# EAGLE design KEYb_final-rev01 (EAGLE 9.6.2)
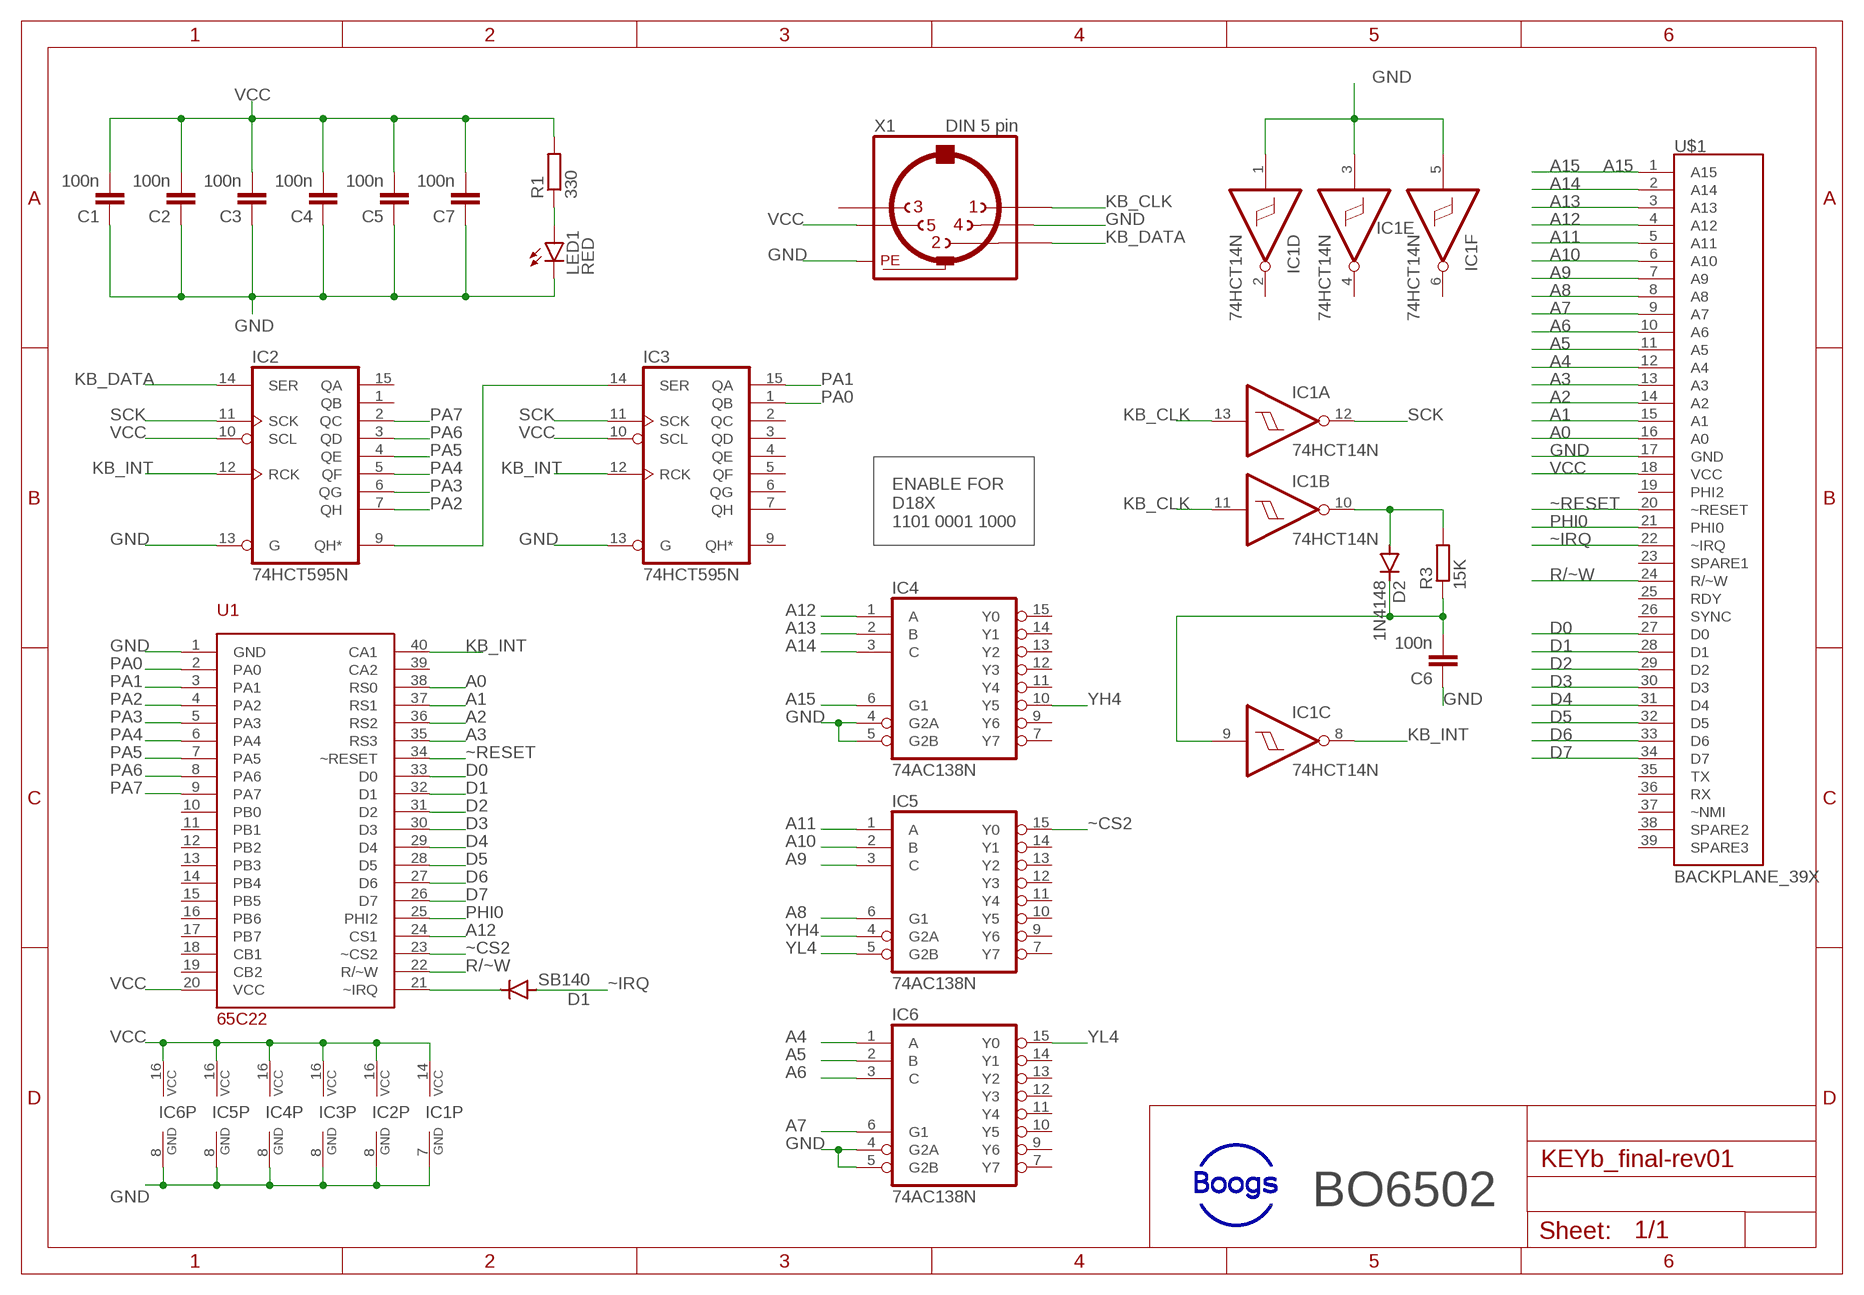
[diagram p0: schematic, sheet 1]

## Parts
C1  100n  C-EU025-025X050  [C025-025X050]
C2  100n  C-EU025-025X050  [C025-025X050]
C3  100n  C-EU025-025X050  [C025-025X050]
C4  100n  C-EU025-025X050  [C025-025X050]
C5  100n  C-EU025-025X050  [C025-025X050]
C6  100n  C-EU025-025X050  [C025-025X050]
C7  100n  C-EU025-025X050  [C025-025X050]
D1  SB140  1N4004  [DO41-10]
D2  1N4148  1N4148DO35-7  [DO35-7]
IC1  74HCT14N  [DIL14]
IC2  74HCT595N  [DIL16]
IC3  74HCT595N  [DIL16]
IC4  74AC138N  [DIL16]
IC5  74AC138N  [DIL16]
IC6  74AC138N  [DIL16]
LED1  RED  LED5MM  [LED5MM]
R1  330  R-EU_0207/10  [0207/10]
R3  15K  R-EU_0207/10  [0207/10]
U1  65C22  [DIL40]
U$1  BACKPLANE_39X  [BP_39X]
X1  DIN 5 pin  MAB5SH  [MAB5SH]

## Nets
A0: U1.38(RS0) U$1.16(A0)
A1: U1.37(RS1) U$1.15(A1)
A2: U1.36(RS2) U$1.14(A2)
A3: U1.35(RS3) U$1.13(A3)
A4: IC6.1(A) U$1.12(A4)
A5: IC6.2(B) U$1.11(A5)
A6: IC6.3(C) U$1.10(A6)
A7: IC6.6(G1) U$1.9(A7)
A8: IC5.6(G1) U$1.8(A8)
A9: IC5.3(C) U$1.7(A9)
A10: IC5.2(B) U$1.6(A10)
A11: IC5.1(A) U$1.5(A11)
A12: IC4.1(A) U1.24(CS1) U$1.4(A12)
A13: IC4.2(B) U$1.3(A13)
A14: IC4.3(C) U$1.2(A14)
A15: IC4.6(G1) U$1.1(A15)
D0: U1.33(D0) U$1.27(D0)
D1: U1.32(D1) U$1.28(D1)
D2: U1.31(D2) U$1.29(D2)
D3: U1.30(D3) U$1.30(D3)
D4: U1.29(D4) U$1.31(D4)
D5: U1.28(D5) U$1.32(D5)
D6: U1.27(D6) U$1.33(D6)
D7: U1.26(D7) U$1.34(D7)
GND: C1.1 C2.1 C3.1 C4.1 C5.1 C6.1 C7.1 IC1.1(D:I) IC1.3(E:I) IC1.5(F:I) IC1.7(P:GND) IC2.8(GND) IC2.13(G) IC3.8(GND) IC3.13(G) IC4.4(G2A) IC4.5(G2B) IC4.8(GND) IC5.8(GND) IC6.4(G2A) IC6.5(G2B) IC6.8(GND) LED1.K(C) U1.1(GND) U$1.17(GND) X1.4 X1.PE X1.PE@(PE)
KB_CLK: IC1.11(B:I) IC1.13(A:I) X1.1
KB_DATA: IC2.14(SER) X1.2
KB_INT: IC1.8(C:O) IC2.12(RCK) IC3.12(RCK) U1.40(CA1)
N$1: D1.C U1.21(~IRQ)
N$2: IC2.9(QH*) IC3.14(SER)
N$4: D2.A IC1.10(B:O) R3.2
N$5: C6.2 D2.C IC1.9(C:I) R3.1
N$6: LED1.A R1.1
PA0: IC3.1(QB) U1.2(PA0)
PA1: IC3.15(QA) U1.3(PA1)
PA2: IC2.7(QH) U1.4(PA2)
PA3: IC2.6(QG) U1.5(PA3)
PA4: IC2.5(QF) U1.6(PA4)
PA5: IC2.4(QE) U1.7(PA5)
PA6: IC2.3(QD) U1.8(PA6)
PA7: IC2.2(QC) U1.9(PA7)
PHI0: U1.25(PHI2) U$1.21(PHI0)
R/~W: U1.22(R/~W) U$1.24(R/~W)
SCK: IC1.12(A:O) IC2.11(SCK) IC3.11(SCK)
VCC: C1.2 C2.2 C3.2 C4.2 C5.2 C7.2 IC1.14(P:VCC) IC2.10(SCL) IC2.16(VCC) IC3.10(SCL) IC3.16(VCC) IC4.16(VCC) IC5.16(VCC) IC6.16(VCC) R1.2 U1.20(VCC) U$1.18(VCC) X1.5
YH4: IC4.10(Y5) IC5.4(G2A)
YL4: IC5.5(G2B) IC6.15(Y0)
~CS2: IC5.15(Y0) U1.23(~CS2)
~IRQ: D1.A U$1.22(~IRQ)
~RESET: U1.34(~RESET) U$1.20(~RESET)
Unconnected: IC1.2(D:O) IC1.4(E:O) IC1.6(F:O) IC2.1(QB) IC2.15(QA) IC3.2(QC) IC3.3(QD) IC3.4(QE) IC3.5(QF) IC3.6(QG) IC3.7(QH) IC3.9(QH*) IC4.7(Y7) IC4.9(Y6) IC4.11(Y4) IC4.12(Y3) IC4.13(Y2) IC4.14(Y1) IC4.15(Y0) IC5.7(Y7) IC5.9(Y6) IC5.10(Y5) IC5.11(Y4) IC5.12(Y3) IC5.13(Y2) IC5.14(Y1) IC6.7(Y7) IC6.9(Y6) IC6.10(Y5) IC6.11(Y4) IC6.12(Y3) IC6.13(Y2) IC6.14(Y1) U1.10(PB0) U1.11(PB1) U1.12(PB2) U1.13(PB3) U1.14(PB4) U1.15(PB5) U1.16(PB6) U1.17(PB7) U1.18(CB1) U1.19(CB2) U1.39(CA2) U$1.19(PHI2) U$1.23(SPARE1) U$1.25(RDY) U$1.26(SYNC) U$1.35(TX) U$1.36(RX) U$1.37(~NMI) U$1.38(SPARE2) U$1.39(SPARE3) X1.3

## Notes on the sheet
- ENABLE FOR
  D18X
  1101 0001 1000
- BO6502

## Library data of the parts
C1-C7 = rcl:C-EU: CAPACITOR, European symbol; SPICEPREFIX: C
D1 = diode:1N4004: DIODE general purpose rectifier, 1 A
D2 = diode:1N4148: DIODE high speed (Philips)
IC1 = 74xx-eu:74*14: Hex schmitt trigger INVERTER
IC2 IC3 = 74xx-eu:74*595: 8-bit SHIFT REGISTER, output latch
IC4-IC6 = 74xx-eu:74*138: 3-line to 8-line DECODER/DEMULTIPLEXER
LED1 = led:LED: LED OSRAM: - CHIPLED LG R971, LG N971, LY N971, LG Q971, LY Q971, LO R971, LY R971 LH N974, LH R974 LS Q976, LO Q976, LY Q976 LO Q996 - Hyper CHIPLED LW Q18S LB Q993, LB Q99A, LB R99A - SideLED LS A670, LO A670, LY A670, LG A670, LP A670 LB A673, LV A673, LT A673, LW A673 LH A674 LY A675 LS A676, LA A676, LO A676, LY A676, LW A676 LS A679, LY A679, LG A679 - Hyper Micro SIDELED® LS Y876, LA Y876, LO Y876, LY Y876 LT Y87S - SmartLED LW L88C, LW L88S LB L89C, LB L89S, LG L890 LS L89K, LO L89K, LY L89K LS L896, LA L896, LO L896, LY L896 - TOPLED LS T670, LO T670, LY T670, LG T670, LP T670 LSG T670, LSP T670, LSY T670, LOP T670, LYG T670 LG T671, LOG T671, LSG T671 LB T673, LV T673, LT T673, LW T673 LH T674 LS T676, LA T676, LO T676, LY T676, LB T676, LH T676, LSB T676, LW T676 LB T67C, LV T67C, LT T67C, LS T67K, LO T67K, LY T67K, LW E67C LS E67B, LA E67B, LO E67B, LY E67B, LB E67C, LV E67C, LT E67C LW T67C LS T679, LY T679, LG T679 LS T770, LO T770, LY T770, LG T770, LP T770 LB T773, LV T773, LT T773, LW T773 LH T774 LS E675, LA E675, LY E675, LS T675 LS T776, LA T776, LO T776, LY T776, LB T776 LHGB T686 LT T68C, LB T68C - Hyper Mini TOPLED® LB M676 - Mini TOPLED Santana® LG M470 LS M47K, LO M47K, LY M47K Source: http://www.osram.convergy.de LUXEON: - LUMILED® LXK2-PW12-R00, LXK2-PW12-S00, LXK2-PW14-U00, LXK2-PW14-V00 LXK2-PM12-R00, LXK2-PM12-S00, LXK2-PM14-U00 LXK2-PE12-Q00, LXK2-PE12-R00, LXK2-PE12-S00, LXK2-PE14-T00, LXK2-PE14-U00 LXK2-PB12-K00, LXK2-PB12-L00, LXK2-PB12-M00, LXK2-PB14-N00, LXK2-PB14-P00, LXK2-PB14-Q00 LXK2-PR12-L00, LXK2-PR12-M00, LXK2-PR14-Q00, LXK2-PR14-R00 LXK2-PD12-Q00, LXK2-PD12-R00, LXK2-PD12-S00 LXK2-PH12-R00, LXK2-PH12-S00 LXK2-PL12-P00, LXK2-PL12-Q00, LXK2-PL12-R00 Source: www.luxeon.com KINGBRIGHT: KA-3528ASYC Source: www.kingbright.com
R1 R3 = rcl:R-EU_: RESISTOR, European symbol; SPICEPREFIX: R
U1 = 65xx_family:65C22
U$1 = 65xx_family:BACKPLANE_39X; A15: A15
X1 = con-hirschmann_mod:MAB5SH: Female CONNECTOR 5 pins 90 deg. with shield, horizontal (DIN 41524); OC_FARNELL: 809883; OC_NEWARK: unknown

## Board
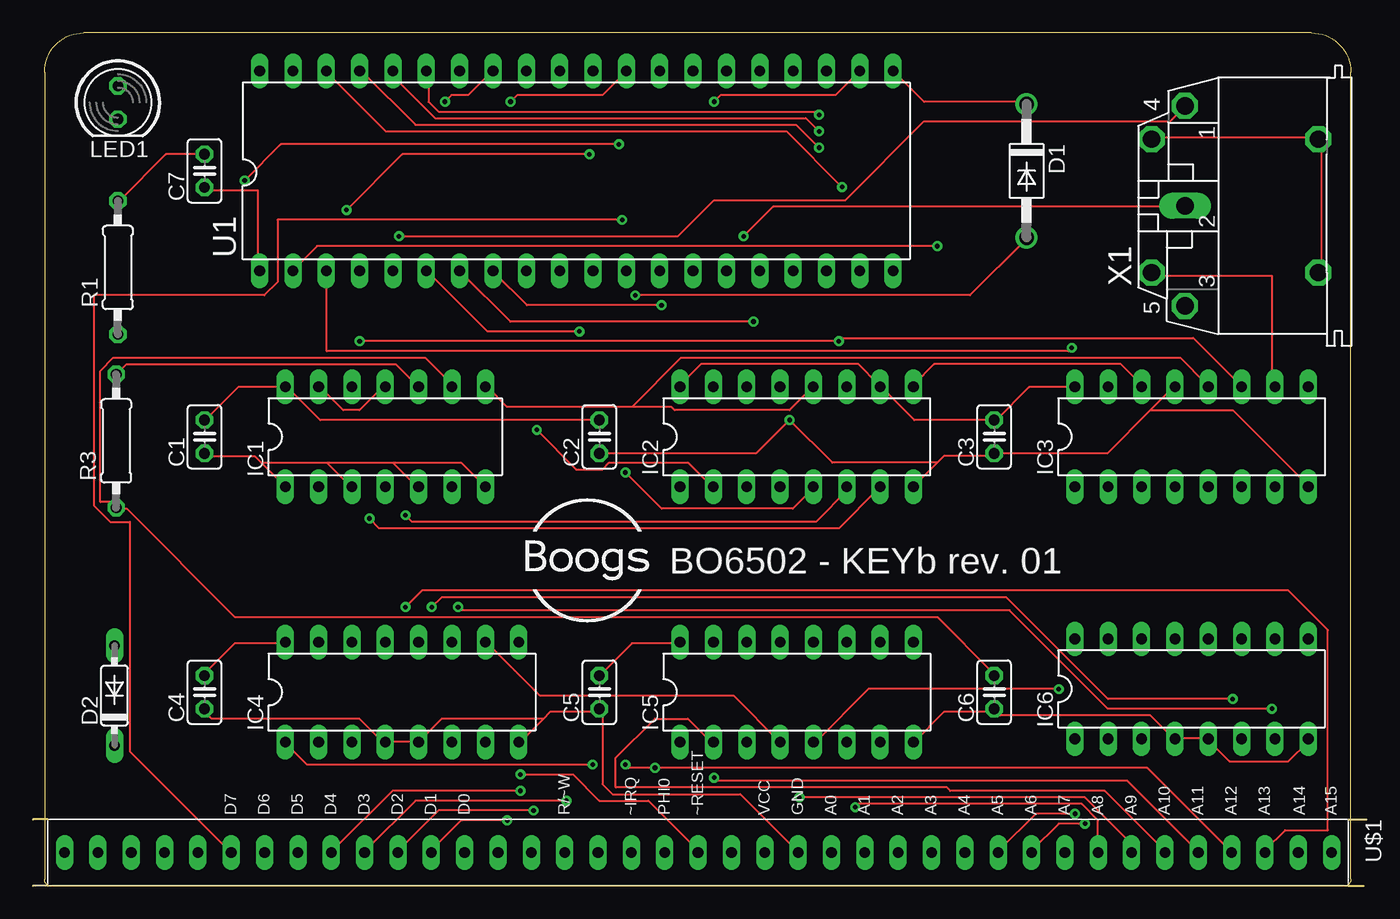
[diagram p1: board, top side]
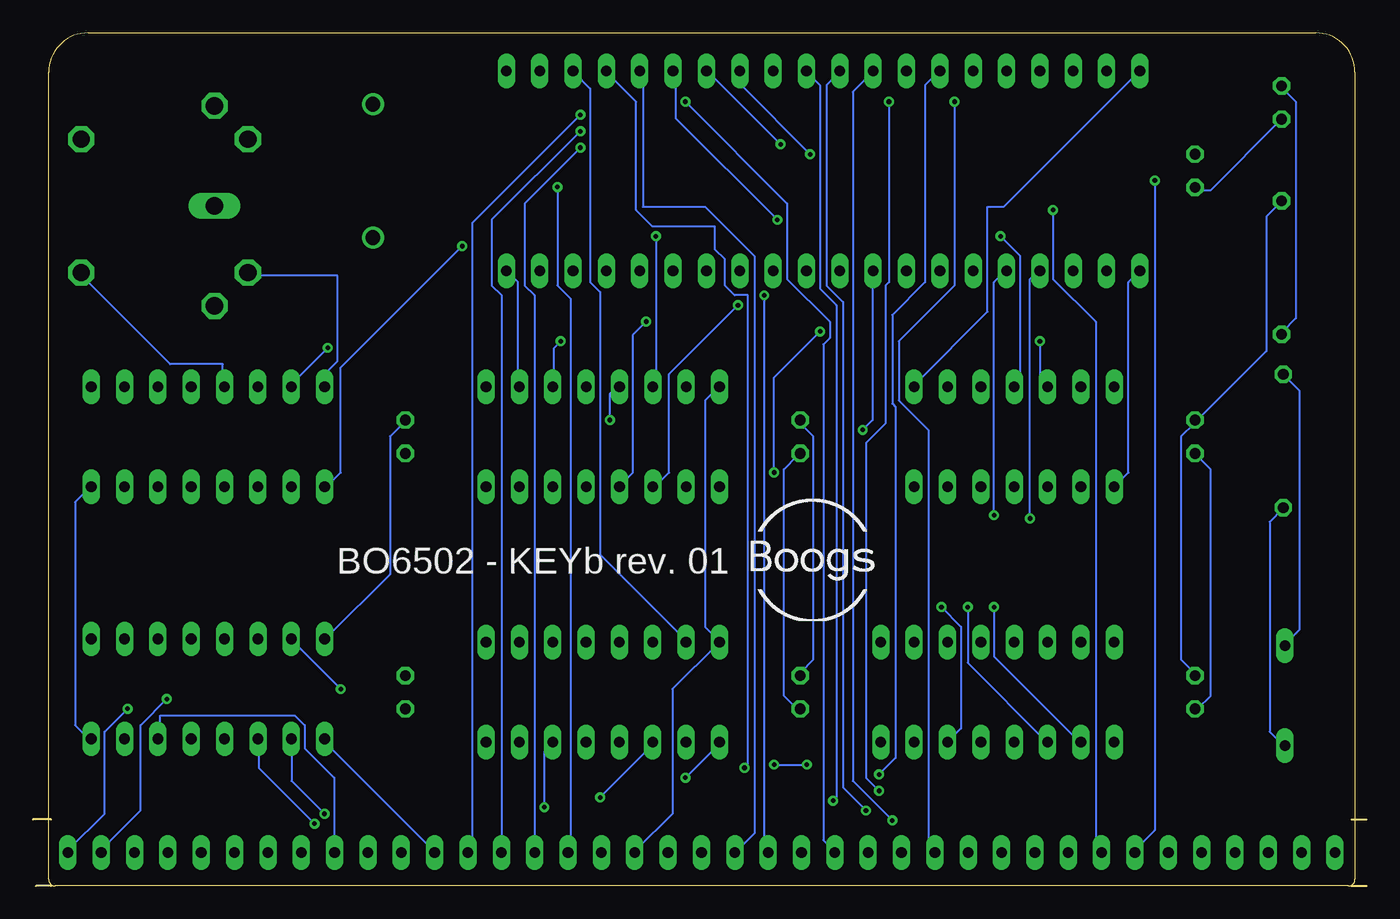
[diagram p2: board, bottom side, seen from below]

Size 101.6 x 65 mm. Coordinates in mm from the lower left corner, seen from the top.
Outline: 1.14,5.08 0,5.08
Outline: 1.14,0 0,0
Outline: 100.2,5.08 101.6,5.08
Outline: 100.2,0 101.35,0
Outline: 1.39,0 99.89,0 arc90 100.39,0.5 100.39,62 arc90 97.39,65 3.89,65 arc90 0.89,62 0.89,0.5 arc90 1.39,0
Copper layers (1*16): Top 0.035mm / dielectric 1.5mm / Bottom 0.035mm
Design rules "default *": minimum track width 6mil, minimum drill 0.35mm, track to track 10mil, track to pad 10mil, pad to pad 10mil, via to via 10mil, smd to smd 6mil, copper to edge 40mil, drill to drill 6mil, minimum pad ring 10mil, minimum via ring 8mil, stop-mask expansion 4mil, vias tented up to drill 15mil, thermal gap 10mil

### Footprints (pad centres in the part's own frame; a part is rotated, then mirrored left to right if it is on the bottom)
C025-025X050 = drill 0.813 octagon: 1 -1.27,0; 2 1.27,0
DO41-10 = drill 1.118: A 5.08,0; C -5.08,0
DO35-7 = drill 0.813 long: A 3.81,0; C -3.81,0
DIL14 = drill 0.813 long: 1 -7.62,-3.81; 2 -5.08,-3.81; 3 -2.54,-3.81; 4 0,-3.81; 5 2.54,-3.81; 6 5.08,-3.81; 7 7.62,-3.81; 8 7.62,3.81; 9 5.08,3.81; 10 2.54,3.81; 11 0,3.81; 12 -2.54,3.81; 13 -5.08,3.81; 14 -7.62,3.81
DIL16 = drill 0.813 long: 1 -8.89,-3.81; 2 -6.35,-3.81; 3 -3.81,-3.81; 4 -1.27,-3.81; 5 1.27,-3.81; 6 3.81,-3.81; 7 6.35,-3.81; 8 8.89,-3.81; 9 8.89,3.81; 10 6.35,3.81; 11 3.81,3.81; 12 1.27,3.81; 13 -1.27,3.81; 14 -3.81,3.81; 15 -6.35,3.81; 16 -8.89,3.81
LED5MM = drill 0.813 octagon: A -1.27,0; K 1.27,0
0207/10 = drill 0.813 octagon: 1 -5.08,0; 2 5.08,0
DIL40 = drill 0.813 long: 1 -24.13,-7.62; 2 -21.59,-7.62; 3 -19.05,-7.62; 4 -16.51,-7.62; 5 -13.97,-7.62; 6 -11.43,-7.62; 7 -8.89,-7.62; 8 -6.35,-7.62; 9 -3.81,-7.62; 10 -1.27,-7.62; 11 1.27,-7.62; 12 3.81,-7.62; 13 6.35,-7.62; 14 8.89,-7.62; 15 11.43,-7.62; 16 13.97,-7.62; 17 16.51,-7.62; 18 19.05,-7.62; 19 21.59,-7.62; 20 24.13,-7.62; 21 24.13,7.62; 22 21.59,7.62; 23 19.05,7.62; 24 16.51,7.62; 25 13.97,7.62; 26 11.43,7.62; 27 8.89,7.62; 28 6.35,7.62; 29 3.81,7.62; 30 1.27,7.62; 31 -1.27,7.62; 32 -3.81,7.62; 33 -6.35,7.62; 34 -8.89,7.62; 35 -11.43,7.62; 36 -13.97,7.62; 37 -16.51,7.62; 38 -19.05,7.62; 39 -21.59,7.62; 40 -24.13,7.62
BP_39X = drill 0.813 long: 1 1.27,59.69; 2 1.27,57.15; 3 1.27,54.61; 4 1.27,52.07; 5 1.27,49.53; 6 1.27,46.99; 7 1.27,44.45; 8 1.27,41.91; 9 1.27,39.37; 10 1.27,36.83; 11 1.27,34.29; 12 1.27,31.75; 13 1.27,29.21; 14 1.27,26.67; 15 1.27,24.13; 16 1.27,21.59; 17 1.27,19.05; 18 1.27,16.51; 19 1.27,13.97; 20 1.27,11.43; 21 1.27,8.89; 22 1.27,6.35; 23 1.27,3.81; 24 1.27,1.27; 25 1.27,-1.27; 26 1.27,-3.81; 27 1.27,-6.35; 28 1.27,-8.89; 29 1.27,-11.43; 30 1.27,-13.97; 31 1.27,-16.51; 32 1.27,-19.05; 33 1.27,-21.59; 34 1.27,-24.13; 35 1.27,-26.67; 36 1.27,-29.21; 37 1.27,-31.75; 38 1.27,-34.29; 39 1.27,-36.83
MAB5SH = drill 1.321 octagon: 1 7.62,5.08; 3 -7.62,5.08; 4 5.08,7.62; 5 -5.08,7.62; PE -5.08,-5.08; PE@ 5.08,-5.08 | drill 1.321 long: 2 0,5.08

### Placement (x,y rotation side)
C1  13.08,34.23 90 top
C2  43.15,34.23 90 top
C3  73.23,34.23 90 top
C4  13.08,14.76 90 top
C5  43.15,14.76 90 top
C6  73.23,14.76 90 top
C7  13.08,54.48 90 top
D1  75.69,54.48 270 top
D2  6.22,14.51 90 top
IC1  26.85,34.23 0 top
IC2  58.18,34.23 0 top
IC3  88.27,34.23 0 top
IC4  28.12,14.76 0 top
IC5  58.19,14.76 0 top
IC6  88.27,15.02 0 top
LED1  6.48,59.69 270 top
R1  6.48,47.12 90 top
R3  6.35,33.91 90 top
U1  41.4,54.48 0 top
U$1  39.24,3.81 270 top
X1  92.84,51.82 90 top

### Tracks (layer width: path | path; a pad name or v marks a point on that pad's centre or on a via)
A0  (via drill 0.35)
  Top 0.152: v61.64,53.25 57.39,57.5 26.89,57.5 22.39,62 U1.38
  Bottom 0.152: v61.64,53.25 61.64,45.75 60.64,44.75 60.64,2.75 U$1.16
A1  (via drill 0.35)
  Top 0.152: v59.89,56.25 58.14,58 29.14,58 25.14,62 U1.37
  Bottom 0.152: v59.89,56.25 64.14,52 64.14,45.75 63.39,45 63.39,2.75 U$1.15
A2  (via drill 0.35)
  Top 0.152: v59.89,57.5 58.89,58.5 30.64,58.5 27.64,61.5 27.64,62 U1.36
  Bottom 0.152: v59.89,57.5 66.64,50.75 66.64,45.75 65.89,45 65.89,2.75 U$1.14
A3  (via drill 0.35)
  Top 0.152: v59.89,58.75 59.64,59 30.89,59 30.14,59.75 30.14,62 U1.35
  Bottom 0.152: v59.89,58.75 68.14,50.5 68.14,3 68.39,2.75 U$1.13
A4
  Bottom 0.152: U$1.12 71.14,2.75 79.14,10.75 79.14,11 IC6.1
A5  (via drill 0.35)
  Top 0.152: v79.39,5.5 76.39,5.5 73.64,2.75 U$1.11
  Bottom 0.152: v79.39,5.5 81.89,8 81.89,11 IC6.2
A6  (via drill 0.35)
  Top 0.152: v80.14,4.75 78.14,4.75 76.14,2.75 U$1.10
  Bottom 0.152: v80.14,4.75 84.39,9 84.39,11 IC6.3
A7
  Bottom 0.152: U$1.9 78.64,2.75 78.64,8.25 80.89,10.5 80.89,12.25 81.64,13 91.89,13 91.89,11.25 IC6.6
A8  (via drill 0.35)
  Top 0.152: v62.64,6 62.89,6.25 79.89,6.25 81.14,5 81.14,2.75 U$1.8
  Bottom 0.152: v62.64,6 62.64,10.25 62.14,10.75 IC5.6
A9  (via drill 0.35)
  Top 0.152: v58.39,6.75 80.14,6.75 83.64,3.25 83.64,2.75 U$1.7
  Bottom 0.152: v58.39,6.75 54.39,10.75 IC5.3
A10
  Top 0.152: IC5.2 51.64,11 49.89,12.75 47.39,12.75 44.39,9.75 44.39,7.5 69.64,7.5 69.89,7.25 81.64,7.25 86.14,2.75 U$1.6
A11  (via drill 0.35)
  Top 0.152: v51.89,8.25 52.14,8 83.39,8 88.64,2.75 U$1.5
  Bottom 0.152: v51.89,8.25 49.39,10.75 IC5.1
A12  (via drill 0.35)
  Top 0.152: v42.64,9.25 20.89,9.25 19.39,10.75 IC4.1 | v45.14,9.25 45.39,9 v47.39,9 84.89,9 91.14,2.75 U$1.4
  Bottom 0.152: v45.14,9.25 v42.64,9.25 | v47.39,9 47.14,9.25 47.14,45 48.14,45 48.89,45.75 48.89,47.75 49.64,48.5 49.64,50.25 54.39,50.25 55.64,51.5 55.64,59.75 57.89,62 U1.24
A13  (via drill 0.35)
  Top 0.152: v28.39,21.25 29.64,22.5 95.64,22.5 98.64,19.5 98.64,4.25 95.39,4.25 93.89,2.75 U$1.3
  Bottom 0.152: v28.39,21.25 28.39,17.5 21.89,11 IC4.2
A14  (via drill 0.35)
  Top 0.152: v30.39,21.25 31.14,22 74.14,22 81.89,14.25 v91.39,14.25
  Bottom 0.152: v30.39,21.25 30.39,17 24.39,11 IC4.3 | v91.39,14.25 93.39,12.25 93.39,5.75 96.39,2.75 U$1.2
A15  (via drill 0.35)
  Top 0.152: v32.39,21.25 32.64,21 74.39,21 81.89,13.5 v94.39,13.5
  Bottom 0.152: v32.39,21.25 30.89,19.75 30.89,12 31.89,11 IC4.6 | v94.39,13.5 96.14,11.75 96.14,5.5 98.89,2.75 U$1.1
D0  (via drill 0.35)
  Top 0.152: v31.39,59.75 31.89,60.25 33.14,60.25 34.89,62 U1.33
  Bottom 0.152: v31.39,59.75 31.39,45.75 35.64,41.5 35.64,37 33.39,34.75 33.39,3 33.14,2.75 U$1.27
D1  (via drill 0.35)
  Top 0.152: v36.14,5 32.64,5 30.39,2.75 U$1.28
  Bottom 0.152: v36.14,5 39.14,8 39.14,60.5 37.64,62 U1.32
D2  (via drill 0.35)
  Top 0.152: v38.14,5.75 30.89,5.75 27.89,2.75 U$1.29
  Bottom 0.152: v38.14,5.75 39.89,7.5 39.89,44.5 41.14,45.75 41.14,61 40.14,62 U1.31
D3  (via drill 0.35)
  Top 0.152: v40.64,6.5 29.14,6.5 25.39,2.75 U$1.30
  Bottom 0.152: v40.64,6.5 40.39,6.75 40.39,44.25 41.64,45.5 41.64,61 42.64,62 U1.30
D4  (via drill 0.35)
  Top 0.152: v37.14,7.25 27.39,7.25 22.89,2.75 U$1.31 | v36.39,59.75 36.89,60.25 43.39,60.25 45.14,62 U1.29
  Bottom 0.152: v37.14,7.25 38.14,8.25 38.14,33.75 36.64,35.25 36.64,45.75 36.39,46 v36.39,59.75
D5  (via drill 0.35)
  Top 0.152: v23.89,51.5 28.14,55.75 v42.39,55.75
  Bottom 0.152: v23.89,51.5 23.89,46.25 20.64,43 20.64,3 20.39,2.75 U$1.32 | v42.39,55.75 47.64,61 47.64,62 U1.28
D6  (via drill 0.35)
  Top 0.152: v16.14,53.75 18.89,56.5 v44.64,56.5
  Bottom 0.152: v16.14,53.75 16.14,4.25 17.64,2.75 U$1.33 | v44.64,56.5 50.14,62 U1.27
D7  (via drill 0.35)
  Top 0.152: v44.89,50.75 18.64,50.75 18.64,46 17.64,45 4.64,45 4.64,29 5.89,27.75 7.39,27.75 7.39,10.25 14.89,2.75 U$1.34
  Bottom 0.152: v44.89,50.75 52.64,58.5 52.64,62 U1.26
GND  (via drill 0.35)
  Top 0.152: IC5.8 67.14,11 69.39,13.25 73.14,13.25 C6.1 73.39,13.25 73.64,13 85.14,13 86.89,11.25 IC6.4 87.14,11.25 89.39,11.25 IC6.5 89.64,11 91.14,9.5 95.64,9.5 97.14,11 IC6.8 | X1.PE 98.14,46.75 98.14,56.75 X1.PE@ 97.89,57 85.39,57 X1.4 | 68.89,32.25 69.39,32.75 73.14,32.75 C3.1 73.39,33 81.89,33 85.14,36.25 | 68.89,32.25 67.14,30.5 IC2.8 | 68.89,32.25 60.89,32.25 v57.64,35.5 55.14,33 43.39,33 C2.1 | 85.14,36.25 86.89,38 IC3.13 | 85.14,36.25 91.39,36.25 97.14,30.5 IC3.8 | U1.1 17.14,47 17.14,53 13.14,53 C7.1 | 17.39,32.25 16.89,32.75 13.14,32.75 C1.1 | 17.39,32.25 19.14,30.5 IC1.1 | 22.39,32.25 24.14,30.5 IC1.3 | 17.39,32.25 22.39,32.25 | 27.39,32.25 29.14,30.5 IC1.5 | 22.39,32.25 27.39,32.25 | 27.39,32.25 32.64,32.25 34.39,30.5 IC1.7 | C4.1 13.14,13.25 13.64,12.75 24.89,12.75 26.64,11 IC4.4 26.89,11 29.14,11 IC4.5 29.39,11 31.14,12.75 38.89,12.75 | 38.89,12.75 39.39,13.25 43.14,13.25 C5.1 43.39,13.25 43.39,7.75 44.14,7 53.89,7 58.14,2.75 U$1.17 | 38.89,12.75 37.14,11 IC4.8
  Bottom 0.152: v57.64,35.5 57.64,37.5 57.14,38 IC2.13 | X1.PE 97.89,46.5 91.14,39.75 87.14,39.75 87.14,38.25 IC3.13 | IC6.8 97.39,11.25 98.39,12.25 98.39,29.25 97.39,30.25 IC3.8 | LED1.K 6.64,58.25 11.89,53 12.89,53 C7.1 | U1.1 17.39,46.75 18.14,46 18.14,31.5 19.14,30.5 IC1.1 | C2.1 43.39,32.75 44.39,31.75 44.39,14.5 43.39,13.5 C5.1 | C1.1 12.89,32.75 11.89,31.75 11.89,14.5 12.89,13.5 C4.1
KB_CLK  (via drill 0.35)
  Top 0.152: IC1.13 21.89,38 23.64,36.25 24.89,36.25 26.64,38 IC1.11 | v27.89,49.5 49.14,49.5 51.89,52.25 61.89,52.25 67.89,58.25 86.64,58.25 87.64,59.25 X1.1
  Bottom 0.152: v27.89,49.5 26.39,48 26.39,38.5 26.64,38.25 IC1.11
KB_DATA  (via drill 0.35)
  Top 0.152: v54.14,49.5 56.39,51.75 87.64,51.75 X1.2
  Bottom 0.152: v54.14,49.5 54.14,38.25 IC2.14
KB_INT
  Top 0.152: 45.64,36.5 48.64,36.5 48.89,36.25 57.64,36.25 59.39,38 IC2.12 | 45.64,36.5 36.14,36.5 34.64,38 IC1.8 | 45.64,36.5 49.39,40.25 87.39,40.25 89.39,38.25 IC3.12
  Bottom 0.152: U1.40 17.39,62 27.64,51.75 28.89,51.75 28.89,43.75 34.39,38.25 IC1.8
N$1
  Top 0.152: U1.21 65.64,62 67.89,59.75 75.64,59.75 D1.C
N$2
  Top 0.152: IC2.9 67.14,38.25 68.64,39.75 82.89,39.75 84.39,38.25 IC3.14
N$4
  Top 0.152: IC1.10 29.14,38.25 27.64,39.75 7.14,39.75 6.39,39 R3.2
  Bottom 0.152: D2.A 6.14,18.5 5.14,19.5 5.14,37.75 6.14,38.75 R3.2
N$5
  Top 0.152: IC1.9 31.89,38.25 29.89,40.25 6.14,40.25 5.14,39.25 5.14,29.25 5.89,29.25 6.14,29 R3.1 6.39,28.75 7.14,28.75 15.39,20.5 68.89,20.5 73.14,16.25 C6.2
  Bottom 0.152: D2.C 6.39,10.75 7.39,11.75 7.39,27.75 6.39,28.75 R3.1
N$6
  Bottom 0.152: R1.1 6.39,42.25 5.39,43.25 5.39,59.75 6.39,60.75 LED1.A
PA0  (via drill 0.35)
  Top 0.152: v68.89,48.75 21.64,48.75 19.89,47 U1.2
  Bottom 0.152: v68.89,48.75 78.14,39.5 78.14,31.5 79.14,30.5 IC3.1
PA1  (via drill 0.35)
  Top 0.152: v79.14,41 78.89,40.75 22.39,40.75 22.39,46.75 U1.3
  Bottom 0.152: v79.14,41 81.89,38.25 IC3.15
PA2  (via drill 0.35)
  Top 0.152: v25.64,28 26.39,27.25 61.39,27.25 64.39,30.25 IC2.7
  Bottom 0.152: v25.64,28 25.64,46.25 25.14,46.75 U1.4
PA3  (via drill 0.35)
  Top 0.152: v28.39,28.25 28.89,27.75 59.64,27.75 62.14,30.25 IC2.6
  Bottom 0.152: v28.39,28.25 28.39,46 27.64,46.75 U1.5
PA4  (via drill 0.35)
  Top 0.152: v41.64,42.25 34.64,42.25 30.14,46.75 U1.6 | v45.14,31.5 47.89,28.75 57.89,28.75 59.39,30.25 IC2.5
  Bottom 0.152: v41.64,42.25 45.14,38.75 v45.14,31.5
PA5  (via drill 0.35)
  Top 0.152: v54.89,43 36.39,43 32.64,46.75 U1.7
  Bottom 0.152: v54.89,43 55.89,42 55.89,31.5 56.89,30.5 IC2.4
PA6  (via drill 0.35)
  Top 0.152: v47.89,44.25 37.64,44.25 35.14,46.75 U1.8
  Bottom 0.152: v47.89,44.25 53.14,39 53.14,31.5 54.14,30.5 IC2.3
PA7  (via drill 0.35)
  Top 0.152: v38.39,34.75 41.39,31.75 43.39,31.75 43.89,32.25 49.89,32.25 51.64,30.5 IC2.2
  Bottom 0.152: v38.39,34.75 37.64,35.5 37.64,46.75 U1.9
PHI0
  Bottom 0.152: U$1.21 47.89,2.75 46.64,4 46.64,48 50.39,51.75 55.14,51.75 55.14,62 U1.25
R/~W  (via drill 0.35)
  Top 0.152: v51.89,59.75 52.39,60.25 61.14,60.25 U1.22
  Bottom 0.152: v51.89,59.75 44.14,52 44.14,46.25 40.89,43 40.89,41.75 41.39,41.25 41.39,3.5 40.64,2.75 U$1.24
SCK  (via drill 0.35)
  Top 0.152: v24.89,41.5 v61.39,41.5 61.64,41.75 88.39,41.75 91.89,38.25 IC3.11
  Bottom 0.152: v24.89,41.5 24.89,38.75 24.39,38.25 IC1.12 | v61.39,41.5 61.89,41 61.89,38.25 IC2.11
VCC
  Top 0.152: C4.2 13.14,16.25 15.39,18.5 19.14,18.5 IC4.16 | C1.2 13.14,35.5 15.64,38 19.14,38 IC1.14 19.39,38 21.89,35.5 C2.2 | R1.2 6.64,52.25 10.14,55.75 12.89,55.75 C7.2 | C5.2 43.39,16.25 45.64,18.5 49.14,18.5 IC5.16 | IC2.16 49.39,38.25 50.89,39.75 62.89,39.75 64.39,38.25 IC2.10 64.64,38 67.14,35.5 73.14,35.5 C3.2 73.39,35.5 75.89,38 79.14,38 IC3.16 | IC3.10 94.39,38.25 94.39,46.5 85.39,46.5 X1.5
  Bottom 0.152: R1.2 6.64,52 7.64,51 7.64,40.75 12.89,35.5 C1.2 13.14,35.25 14.14,34.25 14.14,17.25 13.14,16.25 C4.2 | C2.2 43.14,35.25 42.14,34.25 42.14,17.25 43.14,16.25 C5.2 | U$1.18 55.64,2.75 52.89,5.5 52.89,15 49.39,18.5 IC5.16 49.39,18.75 50.39,19.75 50.39,37 49.39,38 IC2.16 | U1.20 65.39,46.75 64.64,46 64.64,38.25 IC2.10 | IC6.16 79.14,19 74.39,23.75 74.39,34.25 73.39,35.25 C3.2 | X1.5 85.14,46.5 78.39,46.5 78.39,40 79.14,39.25 79.14,38.25 IC3.16
YH4
  Top 0.152: IC4.10 34.64,18.5 38.64,14.5 53.39,14.5 56.89,11 IC5.4
YL4  (via drill 0.35)
  Top 0.152: v78.14,15 63.64,15 59.64,11 IC5.5
  Bottom 0.152: v78.14,15 81.89,18.75 IC6.15
~CS2
  Bottom 0.152: IC5.15 51.89,18.75 58.39,25.25 58.39,45.25 59.14,46 59.14,60.75 60.39,62 U1.23
~IRQ  (via drill 0.35)
  Top 0.152: v45.89,45 71.39,45 75.64,49.25 D1.A
  Bottom 0.152: v45.89,45 45.89,3 45.64,2.75 U$1.22
~RESET  (via drill 0.35)
  Top 0.152: v37.14,8.5 41.14,8.5 43.14,6.5 46.89,6.5 50.64,2.75 U$1.20
  Bottom 0.152: v37.14,8.5 35.89,9.75 35.89,36.5 36.14,36.75 36.14,43.5 33.64,46 33.64,61 32.64,62 U1.34

### Text on the board
tNames: BO6502 - KEYb rev. 01 | D7 | D6 | D5 | D4 | D3 | D2 | D1 | D0 | R/~W | ~IRQ | PHI0 | ~RESET | VCC | GND | A0 | A1 | A2 | A3 | A4 | A5 | A6 | A7 | A8 | A9 | A10 | A11 | A12 | A13 | A14 | A15
bNames: BO6502 - KEYb rev. 01